# EAGLE design 373brd (EAGLE 6.6.0)
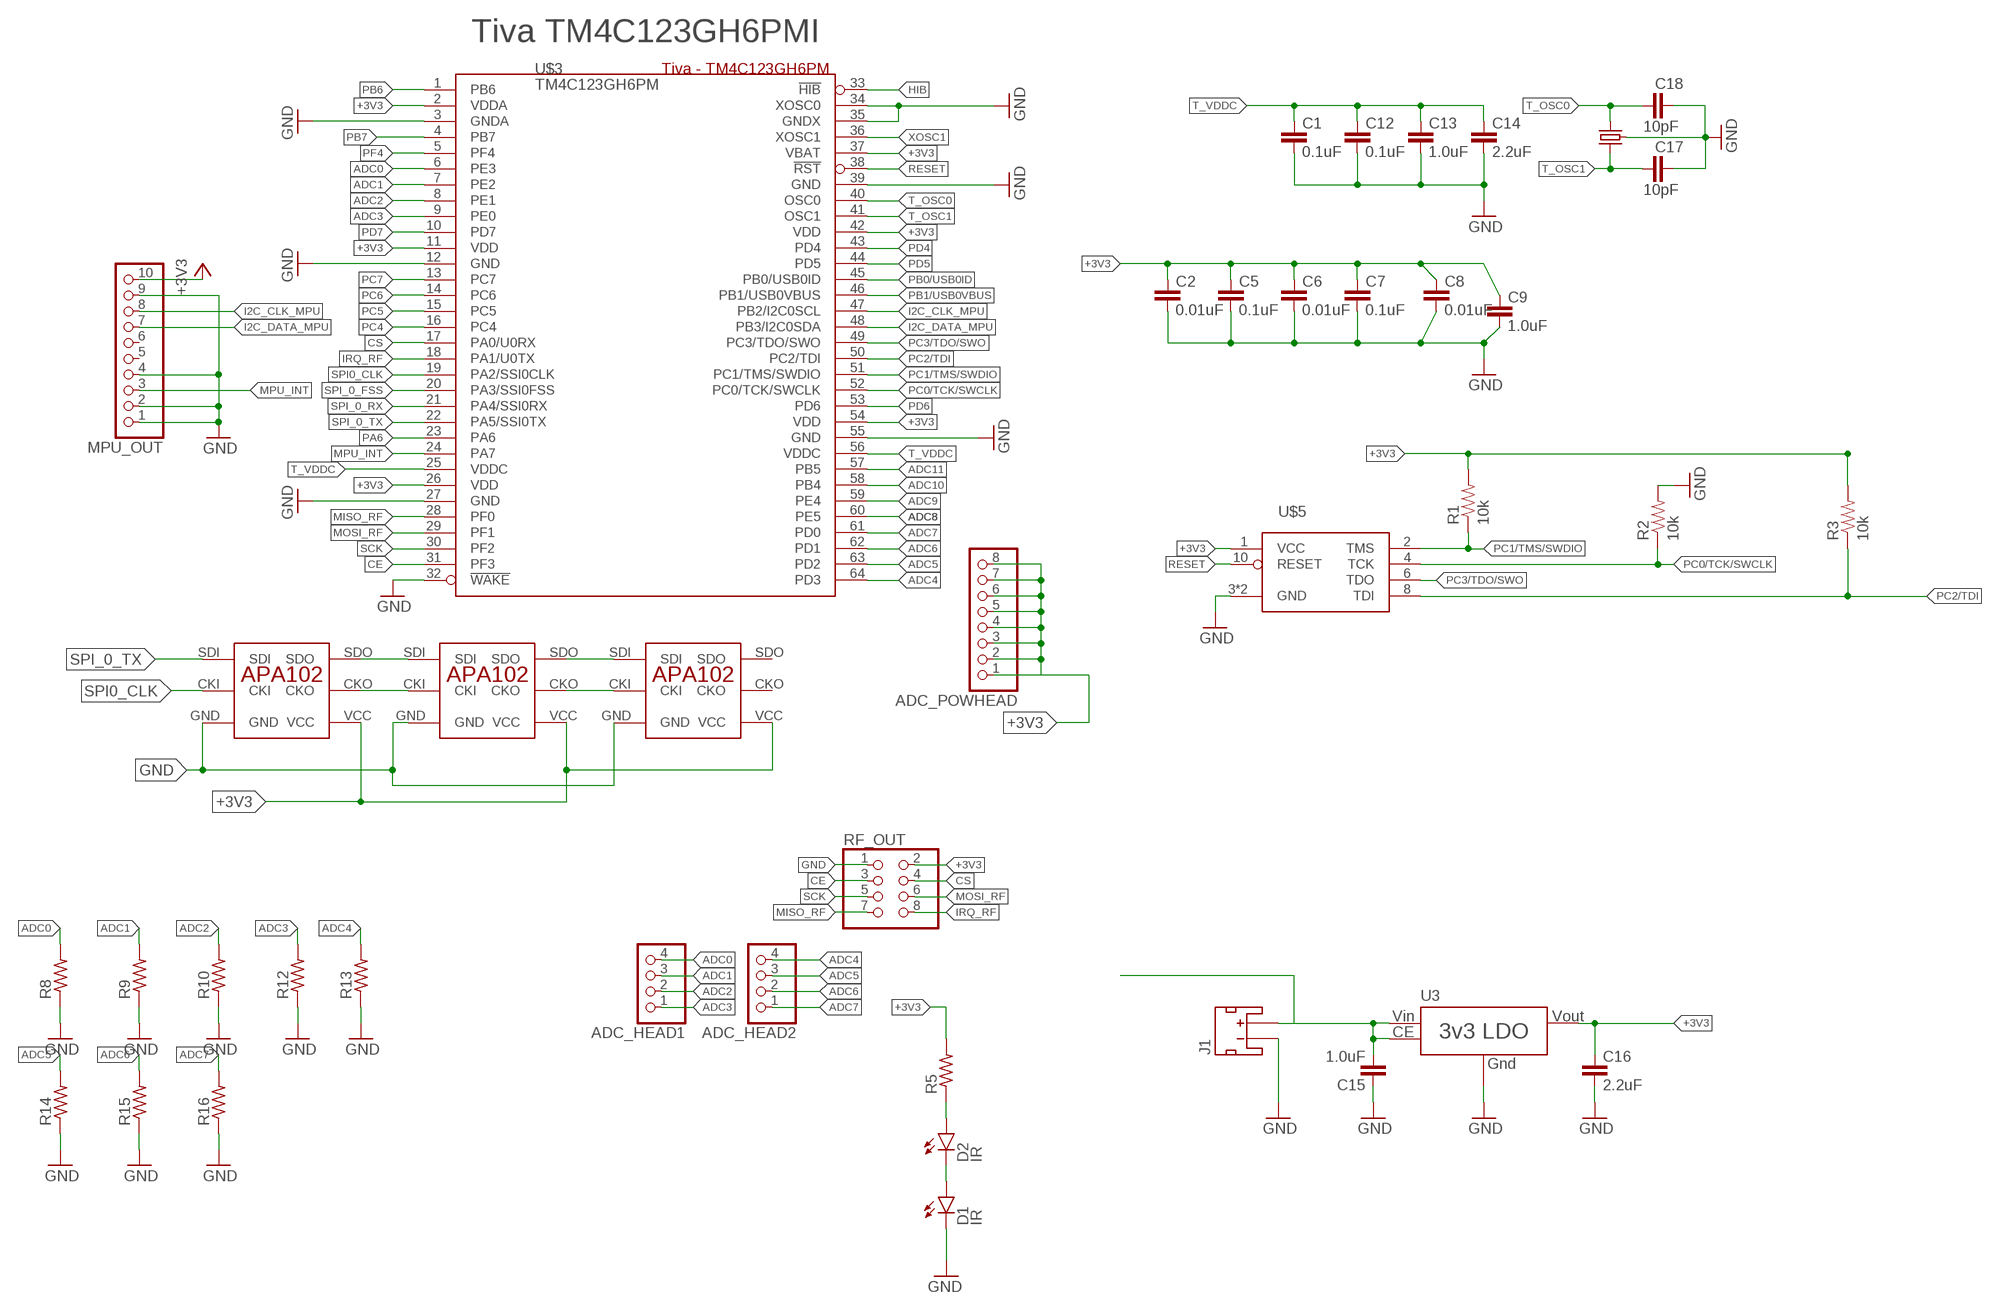
[diagram p0: schematic, sheet 1]

## Parts
ADC_HEAD1  PINHD-1X4  [1X04]
ADC_HEAD2  PINHD-1X4  [1X04]
ADC_POWHEAD  PINHD-1X8  [1X08]
C1  0.1uF  C-EUC0603  [C0603]
C2  0.01uF  C-EUC0603  [C0603]
C5  0.1uF  C-EUC0603  [C0603]
C6  0.01uF  C-EUC0603  [C0603]
C7  0.1uF  C-EUC0603  [C0603]
C8  0.01uF  C-EUC0603  [C0603]
C9  1.0uF  C-EUC0603  [C0603]
C12  0.1uF  C-EUC0603  [C0603]
C13  1.0uF  C-EUC0603  [C0603]
C14  2.2uF  C-EUC0603  [C0603]
C15  1.0uF  C-EUC0805  [C0805]
C16  2.2uF  C-EUC0805  [C0805]
C17  10pF  C-EUC0603  [C0603]
C18  10pF  C-EUC0603  [C0603]
D1  IR  LED-BLUE1206  [LED-1206]
D2  IR  LED-BLUE1206  [LED-1206]
J1  JST_2MM_MALE  [JST-2-SMD]
MPU_OUT  PINHD-1X10  [1X10]
R1  10k  RESISTOR0603-RES  [0603-RES]
R2  10k  RESISTOR0603-RES  [0603-RES]
R3  10k  RESISTOR0603-RES  [0603-RES]
R5  R-US_R0603  [R0603]
R8  R-US_R0603  [R0603]
R9  R-US_R0603  [R0603]
R10  R-US_R0603  [R0603]
R12  R-US_R0603  [R0603]
R13  R-US_R0603  [R0603]
R14  R-US_R0603  [R0603]
R15  R-US_R0603  [R0603]
R16  R-US_R0603  [R0603]
RF_OUT  PINHD-2X4  [2X04]
U3  XC6210  [SOT-25]
U$1  CRYSTAL_403C11E16  [4-SMD-SWITCH]
U$2  APA102  [APA102]
U$3  TM4C123GH6PM  [TM4C123GH6PM]
U$4  APA102  [APA102]
U$5  JTAG-ARM_TC-10  [TC2050-IDC]
U$6  APA102  [APA102]

## Nets
+3V3: ADC_POWHEAD.1 ADC_POWHEAD.2 ADC_POWHEAD.3 ADC_POWHEAD.4 ADC_POWHEAD.5 ADC_POWHEAD.6 ADC_POWHEAD.7 ADC_POWHEAD.8 C2.1 C5.1 C6.1 C7.1 C8.1 C9.1 C16.1 MPU_OUT.10 R1.2 R3.2 R5.2 RF_OUT.2 U3.5(VOUT) U$2.VCC U$3.2(VDDA) U$3.11(VDD) U$3.26(VDD) U$3.37(VBAT) U$3.42(VDD) U$3.54(VDD) U$4.VCC U$5.1(VCC) U$6.VCC
ADC0: ADC_HEAD1.4 R8.2 U$3.6(PE3)
ADC1: ADC_HEAD1.3 R9.2 U$3.7(PE2)
ADC2: ADC_HEAD1.2 R10.2 U$3.8(PE1)
ADC3: ADC_HEAD1.1 R12.2 U$3.9(PE0)
ADC4: ADC_HEAD2.4 R13.2 U$3.64(PD3)
ADC5: ADC_HEAD2.3 R14.2 U$3.63(PD2)
ADC6: ADC_HEAD2.2 R15.2 U$3.62(PD1)
ADC7: ADC_HEAD2.1 R16.2 U$3.61(PD0)
ADC8: U$3.60(PE5)
ADC9: U$3.59(PE4)
ADC10: U$3.58(PB4)
ADC11: U$3.57(PB5)
BATT_IN: C15.2 J1.2(+) U3.1(VIN) U3.3(CE)
CE: RF_OUT.3 U$3.31(PF3)
CS: RF_OUT.4 U$3.17(PA0/U0RX)
GND: C1.2 C2.2 C5.2 C6.2 C7.2 C8.2 C9.2 C12.2 C13.2 C14.2 C15.1 C16.2 C17.2 C18.2 D1.C J1.1(-) MPU_OUT.1 MPU_OUT.2 MPU_OUT.4 MPU_OUT.9 R2.2 R8.1 R9.1 R10.1 R12.1 R13.1 R14.1 R15.1 R16.1 RF_OUT.1 U3.2(GND) U$1.2(GND) U$1.4(GND) U$2.GND U$3.3(GNDA) U$3.12(GND) U$3.27(GND) U$3.32(!WAKE) U$3.34(XOSC0) U$3.35(GNDX) U$3.39(GND) U$3.55(GND) U$4.GND U$5.3(GND) U$5.9(GND) U$6.GND
HIB: U$3.33(!HIB)
I2C_CLK_MPU: MPU_OUT.8 U$3.47(PB2/I2C0SCL)
I2C_DATA_MPU: MPU_OUT.7 U$3.48(PB3/I2C0SDA)
IRQ_RF: RF_OUT.8 U$3.18(PA1/U0TX)
MISO_RF: RF_OUT.7 U$3.28(PF0)
MOSI_RF: RF_OUT.6 U$3.29(PF1)
MPU_INT: MPU_OUT.3 U$3.24(PA7)
N$1: U$2.SDO U$4.SDI
N$2: U$2.CKO U$4.CKI
N$3: U$4.SDO U$6.SDI
N$4: U$4.CKO U$6.CKI
N$5: D1.A D2.C
N$7: D2.A R5.1
PA6: U$3.23(PA6)
PB0/USB0ID: U$3.45(PB0/USB0ID)
PB1/USB0VBUS: U$3.46(PB1/USB0VBUS)
PB6: U$3.1(PB6)
PB7: U$3.4(PB7)
PC0/TCK/SWCLK: R2.1 U$3.52(PC0/TCK/SWCLK) U$5.4(TCK)
PC1/TMS/SWDIO: R1.1 U$3.51(PC1/TMS/SWDIO) U$5.2(TMS)
PC2/TDI: R3.1 U$3.50(PC2/TDI) U$5.8(TDI)
PC3/TDO/SWO: U$3.49(PC3/TDO/SWO) U$5.6(TDO)
PC4: U$3.16(PC4)
PC5: U$3.15(PC5)
PC6: U$3.14(PC6)
PC7: U$3.13(PC7)
PD4: U$3.43(PD4)
PD5: U$3.44(PD5)
PD6: U$3.53(PD6)
PD7: U$3.10(PD7)
PF4: U$3.5(PF4)
RESET: U$3.38(!RST) U$5.10(RESET)
SCK: RF_OUT.5 U$3.30(PF2)
SPI0_CLK: U$2.CKI U$3.19(PA2/SSI0CLK)
SPI_0_FSS: U$3.20(PA3/SSI0FSS)
SPI_0_RX: U$3.21(PA4/SSI0RX)
SPI_0_TX: U$2.SDI U$3.22(PA5/SSI0TX)
T_OSC0: C18.1 U$1.3 U$3.40(OSC0)
T_OSC1: C17.1 U$1.1 U$3.41(OSC1)
T_VDDC: C1.1 C12.1 C13.1 C14.1 U$3.25(VDDC) U$3.56(VDDC)
XOSC1: U$3.36(XOSC1)
Unconnected: J1.NC1(PAD1) J1.NC2(PAD2) MPU_OUT.5 MPU_OUT.6 U$6.CKO U$6.SDO

## Notes on the sheet
- Tiva TM4C123GH6PMI

## Library data of the parts
ADC_HEAD1 ADC_HEAD2 = pinhead:PINHD-1X4: PIN HEADER
ADC_POWHEAD = pinhead:PINHD-1X8: PIN HEADER
C1 C2 C5-C9 C12-C16 = Jon_LIB:C-EU: CAPACITOR, European symbol
C17 C18 = Jon_LIB:C-EU: CAPACITOR, European symbol; DIGIKEY#: 399-1049-1-ND
D1 D2 = SparkFun-LED:LED-BLUE: Blue LEDs for production use Various blue LEDs stocked by SparkFun production 0603 - DIO-08575 Rebel - DIO-09553 1206 - DIO-09911; PROD_ID: DIO-09911; VALUE: BLUE
J1 = SparkFun-Connectors:JST_2MM_MALE: Mates to single-cell LiPo batteries. CONN-08352; PROD_ID: CONN-08352
MPU_OUT = pinhead:PINHD-1X10: PIN HEADER
R1-R3 = SparkFun-Resistors:RESISTOR: Resistor Basic schematic elements and footprints for 0603, 1206, and PTH resistors.
R5 R8-R10 R12-R16 = resistor:R-US_: RESISTOR, American symbol
RF_OUT = pinhead:PINHD-2X4: PIN HEADER
U3 = MAAV:XC6210; DIGIKEY#: 893-1075-1-ND
U$1 = imu:CRYSTAL_403C11E16; DIGIKEY: 403C11E16M00000
U$2 U$4 U$6 = SAUVE:APA102
U$3 = MAAV:TM4C123GH6PM: Designed by Jason Leung - Michigan Autonomous Aerial Vehicles - Circuits Subteam; DIGIKEY#: 296-35849-ND
U$5 = MAAV:JTAG-ARM

## Board
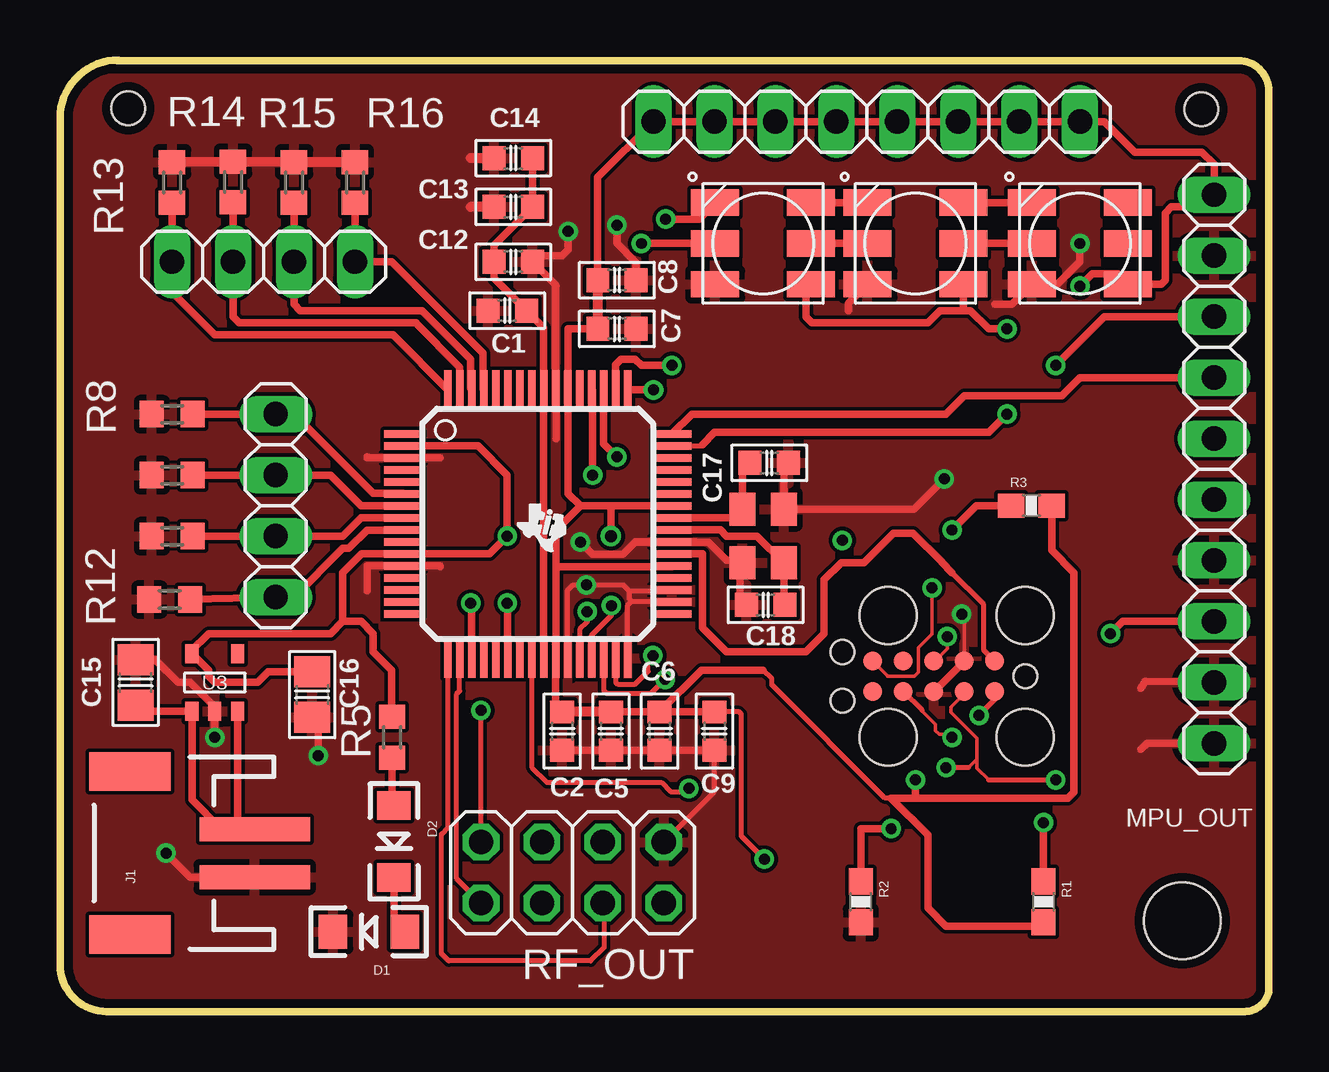
[diagram p1: board, top side]
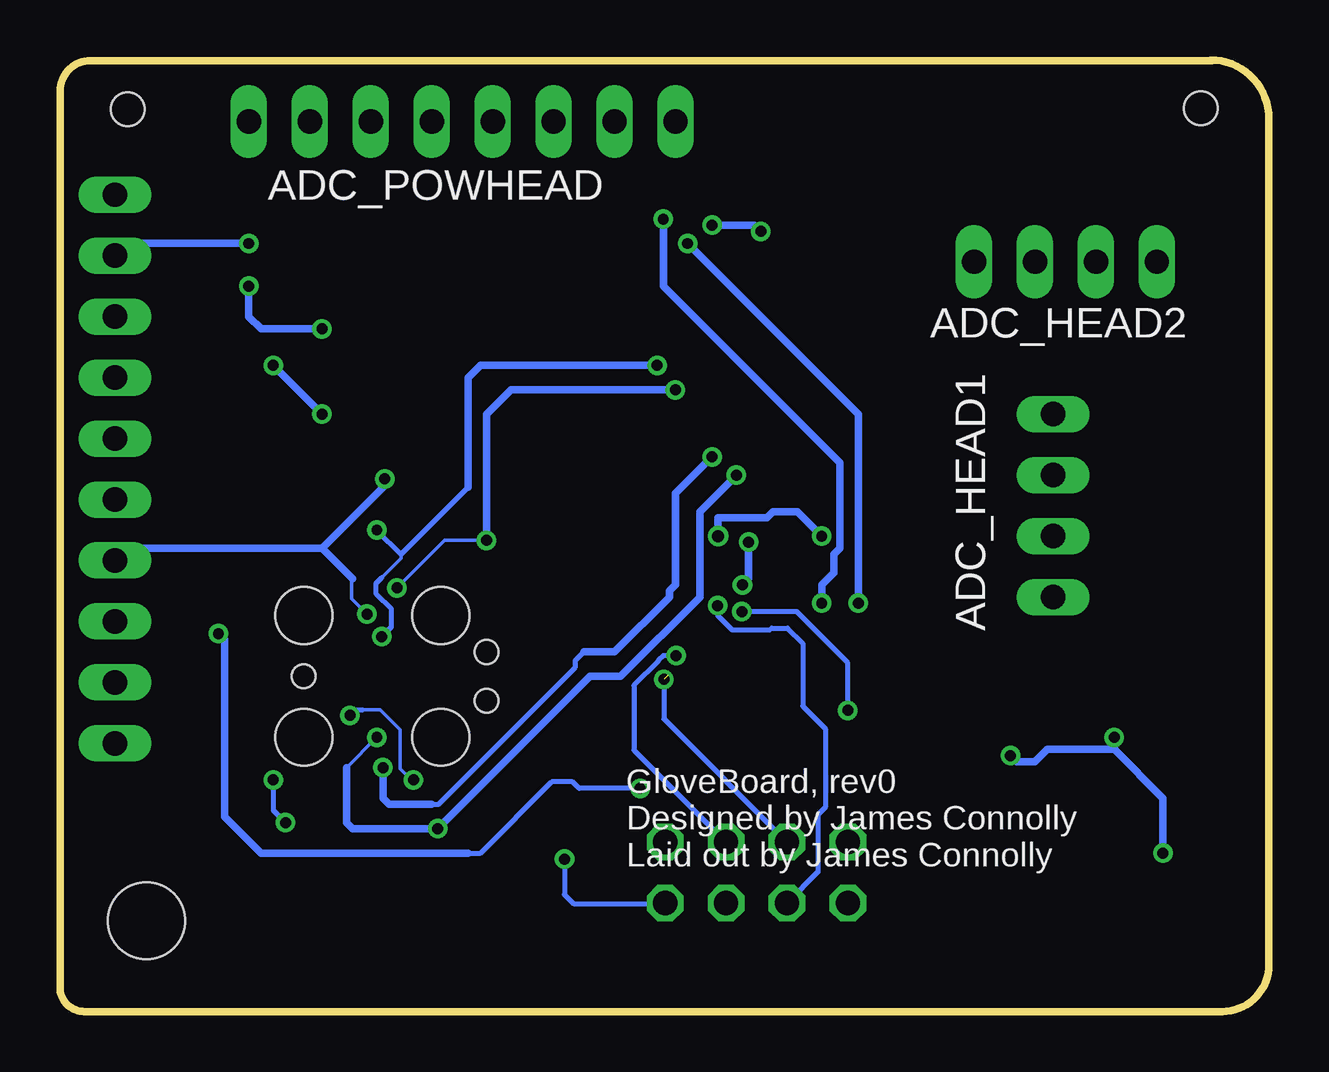
[diagram p2: board, bottom side, seen from below]

Size 50.39 x 39.65 mm. Coordinates in mm from the lower left corner, seen from the top.
Outline: 2.39,39.62 49.12,39.62 arc-90 50.39,38.35 50.39,1.02 arc-90 49.38,0 2.13,0
Outline: 2.03,0 1.96,0 arc-90 0,1.96 0,37.21 arc-90 2.44,39.65
Copper layers (1*16): Top 0.0356mm / dielectric 1.5011mm / Bottom 0.0356mm
Design rules "LaenPCBOrder": minimum track width 6mil, minimum drill 13mil, track to track 6mil, track to pad 6mil, pad to pad 6mil, via to via 6mil, smd to smd 6mil, copper to edge 15mil, drill to drill 6mil, minimum pad ring 7mil, minimum via ring 7mil, stop-mask expansion 3mil, vias tented up to drill 0mil, thermal gap 10mil
Holes 3.2 mm at 46.79,3.78
Holes 1.4 mm at 47.57,37.59 2.84,37.64

### Footprints (pad centres in the part's own frame; a part is rotated, then mirrored left to right if it is on the bottom)
1X04 = drill 1.016 long: 1 -3.81,0; 2 -1.27,0; 3 1.27,0; 4 3.81,0
1X08 = drill 1.016 long: 1 -8.89,0; 2 -6.35,0; 3 -3.81,0; 4 -1.27,0; 5 1.27,0; 6 3.81,0; 7 6.35,0; 8 8.89,0
C0603 = smd 0.95 x 1: 1 -0.8,0; 2 0.8,0
C0805 = smd 1.3 x 1.5: 1 -0.95,0; 2 0.95,0
LED-1206 = smd 1.2 x 1.4: A -1.5,0; C 1.5,0
JST-2-SMD = smd 1 x 4.6: 1 -1,-3.7; 2 1,-3.7 | smd 1.6 x 3.4: NC1 -3.4,1.5; NC2 3.4,1.5
1X10 = drill 1.016 long: 1 -11.43,0; 2 -8.89,0; 3 -6.35,0; 4 -3.81,0; 5 -1.27,0; 6 1.27,0; 7 3.81,0; 8 6.35,0; 9 8.89,0; 10 11.43,0
0603-RES = smd 1.1 x 1: 1 -0.85,0; 2 0.85,0
R0603 = smd 1 x 1.1: 1 -0.85,0; 2 0.85,0
2X04 = drill 1.016 octagon: 1 -3.81,-1.27; 2 -3.81,1.27; 3 -1.27,-1.27; 4 -1.27,1.27; 5 1.27,-1.27; 6 1.27,1.27; 7 3.81,-1.27; 8 3.81,1.27
SOT-25 = smd 0.55 x 0.8: 1 -0.95,-1.2; 2 0,-1.2; 3 0.95,-1.2; 4 0.95,1.2; 5 -0.95,1.2
4-SMD-SWITCH = smd 1.372 x 1.067: 1 -1.118,-0.864; 2 1.118,-0.864; 3 1.118,0.864; 4 -1.118,0.864
APA102 = smd 2 x 1.1: CKI -2,0; CKO 2,0; GND -2,-1.7; SDI -2,1.7; SDO 2,1.7; VCC 2,-1.7
TM4C123GH6PM = smd 1.6 x 0.3: 1 -5.6,3.75; 2 -5.6,3.25; 3 -5.6,2.75; 4 -5.6,2.25; 5 -5.6,1.75; 6 -5.6,1.25; 7 -5.6,0.75; 8 -5.6,0.25; 9 -5.6,-0.25; 10 -5.6,-0.75; 11 -5.6,-1.25; 12 -5.6,-1.75; 13 -5.6,-2.25; 14 -5.6,-2.75; 15 -5.6,-3.25; 16 -5.6,-3.75; 33 5.6,-3.75; 34 5.6,-3.25; 35 5.6,-2.75; 36 5.6,-2.25; 37 5.6,-1.75; 38 5.6,-1.25; 39 5.6,-0.75; 40 5.6,-0.25; 41 5.6,0.25; 42 5.6,0.75; 43 5.6,1.25; 44 5.6,1.75; 45 5.6,2.25; 46 5.6,2.75; 47 5.6,3.25; 48 5.6,3.75 | smd 0.3 x 1.6: 17 -3.75,-5.6; 18 -3.25,-5.6; 19 -2.75,-5.6; 20 -2.25,-5.6; 21 -1.75,-5.6; 22 -1.25,-5.6; 23 -0.75,-5.6; 24 -0.25,-5.6; 25 0.25,-5.6; 26 0.75,-5.6; 27 1.25,-5.6; 28 1.75,-5.6; 29 2.25,-5.6; 30 2.75,-5.6; 31 3.25,-5.6; 32 3.75,-5.6; 49 3.75,5.6; 50 3.25,5.6; 51 2.75,5.6; 52 2.25,5.6; 53 1.75,5.6; 54 1.25,5.6; 55 0.75,5.6; 56 0.25,5.6; 57 -0.25,5.6; 58 -0.75,5.6; 59 -1.25,5.6; 60 -1.75,5.6; 61 -2.25,5.6; 62 -2.75,5.6; 63 -3.25,5.6; 64 -3.75,5.6
TC2050-IDC = smd 0.787 x 0.787: 1 1.27,0.635; 2 2.54,0.635; 3 3.81,0.635; 4 5.08,0.635; 5 6.35,0.635; 6 6.35,-0.635; 7 5.08,-0.635; 8 3.81,-0.635; 9 2.54,-0.635; 10 1.27,-0.635 | hole 0.991: 7.62,1.016; 7.62,-1.016; 0,0 | hole 2.375: 0,2.54; 0,-2.54; 5.715,2.54; 5.715,-2.54

### Placement (x,y rotation side)
ADC_HEAD1  8.99,21.08 90 top
ADC_HEAD2  8.48,31.24 180 top
ADC_POWHEAD  33.63,37.08 180 top
C1  18.64,29.21 180 top
C2  20.93,11.68 270 top
C5  22.96,11.68 270 top
C6  24.99,11.68 270 top
C7  23.22,28.45 0 top
C8  23.22,30.48 0 top
C9  27.28,11.68 270 top
C12  18.9,31.24 0 top
C13  18.9,33.53 180 top
C14  18.9,35.56 180 top
C15  3.15,13.72 270 top
C16  10.52,13.21 270 top
C17  29.57,22.86 0 top
C18  29.41,16.94 180 top
D1  12.88,3.33 180 top
D2  13.92,7.09 270 top
J1  4.42,6.6 90 top
MPU_OUT  48.11,22.61 90 top
R1  41,4.57 270 top
R2  33.38,4.57 270 top
R3  40.49,21.08 0 top
R5  13.84,11.43 90 top
R8  4.67,24.89 0 top
R9  4.67,22.35 0 top
R10  4.67,19.81 0 top
R12  4.57,17.17 0 top
R13  4.67,34.54 270 top
R14  7.21,34.57 270 top
R15  9.75,34.54 270 top
R16  12.29,34.54 270 top
RF_OUT  21.36,5.79 180 top
U3  6.45,13.72 0 top
U$1  29.31,19.81 270 top
U$2  29.31,32 0 top
U$3  19.91,20.32 0 top
U$4  35.66,32 0 top
U$5  40.23,13.97 180 top
U$6  42.52,32 0 top

### Tracks (layer width: path | path; a pad name or v marks a point on that pad's centre or on a via)
+3V3  (via drill 0.46, 0.46 pad 0.3, 0.5)
  Top 0.203: U$5.1 38.96,13 v38.3,12.34 | 34.65,8.89 34.39,8.89 29.67,13.61 29.67,13.87 29.31,14.22 | C9.1 28.31,12.48 28.4,12.39 28.4,7.31 v29.36,6.35
  Top 0.305: U$3.54 21.18,25.92 | 21.18,25.92 21.18,28.45 C7.1 | 25.51,18.54 U$3.37 25.49,18.54 20.68,18.54 | U$3.42 22.96,21.07 | 22.96,21.07 21.69,21.07 | 21.18,25.92 21.18,21.58 21.69,21.07 | v22.96,19.81 22.96,21.07 | C2.1 20.66,12.75 U$3.26 20.68,14.72 20.68,18.54 | 35.66,8.89 42.01,8.89 42.27,9.14 42.27,18.29 41.34,19.22 R3.2 | 35.66,8.89 34.65,8.89 36.17,7.37 36.17,4.32 36.93,3.56 40.83,3.56 R1.2 | C5.1 C6.1 | 29.31,14.22 26.73,14.22 C6.1 | C8.1 22.42,34.76 ADC_POWHEAD.8 ADC_POWHEAD.7 ADC_POWHEAD.6 ADC_POWHEAD.5 ADC_POWHEAD.4 ADC_POWHEAD.3 ADC_POWHEAD.2 ADC_POWHEAD.1 43.54,37.08 44.81,35.81 47.6,35.81 48.11,35.31 MPU_OUT.10 47.6,33.53 46.33,33.53 46.08,33.27 46.08,30.48 45.9,30.3 U$6.VCC 44.09,30.73 43.03,30.73 v42.52,30.23 | U$3.2 17.43,23.57 18.64,22.35 v18.64,19.81 17.9,19.07 U$3.11 12.57,19.07 11.79,18.29 11.79,16.26 | C9.1 C6.1 | C16.1 8.67,14.16 8.23,13.72 6.45,13.72 6.2,13.97 6.2,14.22 U3.5 5.44,14.92 5.44,14.99 6.2,15.75 11.28,15.75 11.79,16.26 | 20.68,18.54 20.68,20.05 21.69,21.07 | 11.79,16.26 12.55,16.26 13.06,15.75 13.06,14.99 13.82,14.22 13.82,12.3 R5.2 | v39.47,28.45 38.71,28.45 37.95,29.21 37.69,29.21 | 37.69,29.21 36.68,29.21 36.17,28.7 31.34,28.7 31.09,28.96 31.09,30.08 U$2.VCC | U$4.VCC 37.66,29.24 37.69,29.21 | v35.66,9.65 35.66,8.89
  Top 0.406: C8.1 C7.1 | C5.1 C2.1
  Bottom 0.152: 37.8,12.57 37.06,12.57 36.22,11.73 36.22,10.11 35.76,9.65 v35.66,9.65
  Bottom 0.203: v38.3,12.34 38.07,12.57 37.8,12.57 | v29.36,6.35 29.36,4.88 28.98,4.5 25.2,4.5 RF_OUT.2
  Bottom 0.305: v39.47,28.45 42.01,28.45 42.52,28.96 v42.52,30.23 | v22.96,19.81 22.96,20.57 20.93,20.57 20.68,20.83 19.66,20.83 v18.64,19.81
ADC0
  Top 0.305: R8.2 ADC_HEAD1.4 9.75,24.89 13.06,21.59 14.29,21.59 U$3.6
ADC1
  Top 0.305: R9.2 ADC_HEAD1.3 11.28,22.35 12.56,21.07 U$3.7
ADC2
  Top 0.305: R10.2 ADC_HEAD1.2 11.79,19.81 12.55,20.57 U$3.8
ADC3
  Top 0.305: R12.2 ADC_HEAD1.1 9.75,17.27 11.79,19.3 12.04,19.3 12.8,20.07 U$3.9
ADC4
  Top 0.305: R13.2 ADC_HEAD2.4 4.67,29.97 6.45,28.19 13.89,28.19 U$3.64
ADC5
  Top 0.305: R14.2 ADC_HEAD2.3 7.21,28.96 7.47,28.7 14.83,28.7 14.83,28.68 16.66,26.85 U$3.63
ADC6
  Top 0.305: R15.2 ADC_HEAD2.2 9.75,29.46 10.01,29.21 15.09,29.21 17.12,27.18 17.12,25.96 U$3.62
ADC7
  Top 0.305: R16.2 ADC_HEAD2.1 13.82,31.24 17.63,27.43 17.63,25.96 U$3.61
BATT_IN
  Top 0.305: 7.47,7.62 6.71,7.62 5.5,8.82 U3.1 3.4,12.52 C15.2 | 7.47,7.62 8.1,7.62 J1.2 | U3.3 7.4,7.69 7.47,7.62
CE  (via drill 0.46)
  Top 0.203: RF_OUT.3 22.61,7.09 | v24.71,14.83 24.51,14.63 24.51,14.17 23.98,13.64 23.24,13.64 23.16,13.72 U$3.31
  Bottom 0.203: v24.71,14.83 25.25,14.83 25.45,14.63 25.45,14.61 26.47,13.59 26.47,10.9 RF_OUT.3
CS
  Top 0.203: RF_OUT.4 22.68,4.47 22.68,2.67 22.12,2.11 16.21,2.11 15.9,2.41 15.9,7.39 16.16,7.65 U$3.17
GND  (via drill 0.46, 0.46 pad 0.3)
  Top 0.152: U$5.9 37.69,16.46 v37.59,16.56
  Top 0.203: 25.46,17.02 U$3.34 25.49,17.09 23.83,17.09 | RF_OUT.1 27.28,9.17 C9.2 | 23.72,17.53 23.47,17.78 v21.95,17.78 21.39,17.78 21.16,17.56 U$3.27 | 23.72,17.53 25.47,17.53 U$3.35 | 23.72,17.53 23.72,17.2 23.83,17.09 | U$3.32 23.66,16.93 23.83,17.09
  Top 0.305: 15.85,18.54 15.85,18.57 U$3.12 12.8,18.57 12.8,17.53 | 15.85,23.07 U$3.3 12.8,23.07 12.8,23.11 | U$3.39 24.24,19.57 24.23,19.56 | 20.68,23.88 20.68,25.92 U$3.55 20.66,30.24 | C9.2 C6.2 C5.2 C2.2 | 20.66,30.24 20.66,30.28 C12.2 19.95,31.5 20.93,31.5 21.18,31.75 v21.18,32.51 | 20.66,30.24 20.68,30.23 | U$3.39 26.51,19.57 26.52,19.56 | U$3.39 23.99,19.57 23.98,19.56 | 26.52,19.56 27.03,19.56 27.79,18.8 28.35,18.8 | 28.35,18.8 U$1.2 | 38.96,29.46 39.68,29.46 U$6.GND 41.58,30.3 42.52,31.24 v42.52,32 | U$4.GND 32.87,29.51 32.87,29.21 | C15.1 3.98,14.67 4.93,13.72 5.44,13.72 6.45,12.7 U3.2 v6.45,11.43 | J1.1 5.42,5.6 v4.42,6.6 | v10.77,10.67 10.77,12 C16.2 | C17.2 30.18,22.67 U$1.4 35.59,20.93 v36.86,22.2 | 21.18,14.74 U$3.27 | MPU_OUT.2 45.24,13.77 45.06,13.46 | MPU_OUT.1 45.31,11.18 45.06,10.92 | C8.2 24.02,31.2 23.22,32 v23.22,32.77 | 36.42,13.21 U$5.3 U$5.9 | 26.52,19.56 23.98,19.56 | 23.98,19.56 23.47,19.05 22.2,19.05 v21.69,19.56 | 28.35,18.8 28.35,17.21 C18.2
  Top 0.406: R16.1 R15.1 R14.1 R13.1 | C13.2 17.12,33.53 | C14.2 17.12,35.56
  Bottom 0.152: v37.59,16.56 38.23,17.2 38.23,18.01
  Bottom 0.203: 38.23,18.01 38.2,18.03
  Bottom 0.305: v4.42,6.6 4.42,8.89 6.45,10.92 | 6.45,10.92 9.25,10.92 9.75,10.41 10.52,10.41 v10.77,10.67 | v6.45,11.43 6.45,10.92 | v23.22,32.77 21.44,32.77 v21.18,32.51 | MPU_OUT.9 47.6,32 v42.52,32 | 38.2,18.03 39.47,19.3 | 39.47,19.3 47.6,19.3 MPU_OUT.4 | v21.69,19.56 21.69,18.03 v21.95,17.78 | v36.86,22.2 36.86,21.92 39.47,19.3
  pour Top: 0,36.17 arc-90 0.05,36.12 0.05,1.68 arc90 1.8,-0.08 49.2,-0.08 arc90 50.44,1.17 50.44,38.35 arc90 49.25,39.55 2.11,39.55 arc90 0.08,37.52
I2C_CLK_MPU  (via drill 0.46)
  Top 0.203: U$3.47 26.72,23.57 26.77,23.62
  Top 0.305: MPU_OUT.8 43.54,28.96 v41.5,26.92 | v39.47,24.89 38.71,24.13 27.28,24.13 26.77,23.62
  Bottom 0.305: v41.5,26.92 v39.47,24.89
I2C_DATA_MPU
  Top 0.305: MPU_OUT.7 42.52,26.42 41.76,25.65 37.69,25.65 36.93,24.89 26.34,24.89 U$3.48
IRQ_RF
  Top 0.203: RF_OUT.8 16.54,5.54 16.54,13.23 16.66,13.36 U$3.18
MISO_RF  (via drill 0.46)
  Top 0.203: v21.97,16.66 21.97,16.23 21.67,15.93 U$3.28 | RF_OUT.7 v17.55,12.55
  Bottom 0.203: v21.97,16.66 19.68,16.66 17.55,14.53 v17.55,12.55
MOSI_RF  (via drill 0.46)
  Top 0.203: U$3.29 22.16,15.69 22.99,16.51 v22.99,16.92
  Bottom 0.203: RF_OUT.6 18.8,5.82 18.8,8.2 18.49,8.51 18.49,11.79 19.43,12.72 19.43,15.34 20.07,15.98 20.73,15.98 20.8,15.9 22.38,15.9 22.99,16.51 v22.99,16.92
MPU_INT  (via drill 0.46)
  Top 0.203: U$3.24 19.66,10.18 20.29,9.55 25.07,9.55 25.45,9.17 26.09,9.17 v26.21,9.3
  Top 0.305: 47.09,16.26 MPU_OUT.3 44.3,16.26 v43.79,15.75
  Bottom 0.203: 33.38,6.6 32.87,6.6 29.9,9.58 29.03,9.58 28.75,9.3 v26.21,9.3
  Bottom 0.305: 33.38,6.6 42.01,6.6 43.54,8.13 43.54,15.49 v43.79,15.75
N$1
  Top 0.305: U$2.SDO U$4.SDI
N$2
  Top 0.305: U$2.CKO U$4.CKI
N$3
  Top 0.305: U$4.SDO U$6.SDI
N$4
  Top 0.305: U$4.CKO U$6.CKI
N$5
  Top 0.305: D2.C 13.92,3.79 D1.A
N$7
  Top 0.305: R5.1 13.84,8.66 D2.A
PC0/TCK/SWCLK  (via drill 0.46, 0.46 pad 0.3)
  Top 0.152: 35.94,12.55 35.94,12.52 36.5,11.96 36.5,11.71 36.65,11.56 37.06,11.56 v37.19,11.43
  Top 0.203: 35.94,12.55 U$5.4
  Top 0.305: v22.2,22.35 22.2,25.88 U$3.52 | v34.65,7.62 33.38,7.62 R2.1
  Top 0.406: U$5.4 35.28,13.33
  Bottom 0.152: v37.19,11.43 38.46,10.16
  Bottom 0.305: v22.2,22.35 23.72,20.83 23.72,17.27 27.03,13.97 28.3,13.97 v34.65,7.62 38.2,7.62 38.46,7.87 38.46,10.16
PC1/TMS/SWDIO  (via drill 0.46, 0.46 pad 0.3)
  Top 0.152: 37.82,13.33 37.8,13.33 37.13,12.67 37.13,12.47 38.23,11.38 38.23,10.52 | 38.23,10.52 37.87,10.16 | 38.23,10.52 38.23,10.13 38.71,9.65
  Top 0.203: 37.87,10.16 v36.93,10.16 | 38.71,9.65 v41.5,9.65
  Top 0.305: U$3.51 22.66,23.67 v23.22,23.11 | R1.1 v41,7.87 | U$5.2 37.82,13.33
  Bottom 0.203: v41.5,9.65 41.5,8.38 v41,7.87 | 34.9,8.64 34.62,8.64 28.91,14.35 28.91,14.63 28.55,14.99
  Bottom 0.305: v23.22,23.11 24.74,21.59 24.74,17.78 24.99,17.53 24.99,17.27 27.28,14.99 28.55,14.99 | v36.93,10.16 36.93,8.89 36.68,8.64 34.9,8.64
PC2/TDI  (via drill 0.46, 0.46 pad 0.3)
  Top 0.152: U$5.8 36.47,14.61 36.98,15.11 v36.98,15.62
  Top 0.305: v25.5,26.92 24.23,26.92 23.98,27.18 23.39,27.18 23.16,26.95 U$3.50 | R3.1 38.2,21.08 v37.19,20.07
  Bottom 0.152: 36.17,19.05 36.17,18.9 36.98,18.09
  Bottom 0.203: 33.38,21.84 36.17,19.05 v37.19,20.07 | v36.98,15.62 36.58,16.03 36.58,16.76 37.21,17.4 37.21,17.86 36.98,18.09
  Bottom 0.305: v25.5,26.92 32.87,26.92 33.38,26.42 33.38,21.84
PC3/TDO/SWO  (via drill 0.46, 0.46 pad 0.3)
  Top 0.152: U$5.6 34.49,13.99 34.49,13.97 35.61,13.97 35.79,14.15 35.79,15.16 36.35,15.72 v36.35,17.65
  Top 0.305: v24.74,25.91 v24.74,25.92 U$3.49
  Bottom 0.152: v36.35,17.65 34.37,19.63 v32.61,19.63 32.66,19.63
  Bottom 0.305: v24.74,25.91 31.6,25.91 32.61,24.89 v32.61,19.63
RESET
  Top 0.203: U$5.10 38.51,15.06 38.51,16.97 37.19,18.29
  Top 0.305: U$3.38 26.77,19.07 26.77,16 27.79,14.99 31.09,14.99 31.85,15.75 31.85,17.98 32.56,18.69 33.5,18.69 34.75,19.94 35.56,19.94 36.75,18.75 36.75,18.72 37.19,18.29 | 38.96,14.73 38.71,14.73
  Top 0.406: U$5.10 38.96,14.73
SCK  (via drill 0.46)  (1 unrouted)
  Top 0.203: RF_OUT.5 20.37,7.34 | U$3.30 22.66,13.38 22.78,13.26 24.64,13.26 v25.22,13.84
  Bottom 0.203: v25.22,13.84 25.22,12.19 RF_OUT.5
SPI0_CLK  (via drill 0.46)
  Top 0.305: U$3.19 17.16,16.97 v17.12,17.02 | v24.23,32 U$2.CKI
  Bottom 0.305: v17.12,17.02 17.12,24.89 v24.23,32
SPI_0_TX  (via drill 0.46)
  Top 0.305: U$3.22 18.66,17 v18.64,17.02 | v25.25,33.02 26.63,33.02 U$2.SDI
  Bottom 0.305: v18.64,17.02 18.64,17.78 18.14,18.29 18.14,19.05 17.88,19.3 17.88,22.86 25.25,30.23 v25.25,33.02
T_OSC0
  Top 0.305: U$3.40 27.53,20.07 27.79,19.81 29.06,19.81 U$1.3 30.18,16.98 C18.1
T_OSC1
  Top 0.305: U$3.41 28.09,20.57 U$1.1 28.45,22.86 C17.1
T_VDDC
  Top 0.305: U$3.25 U$3.56 20.16,28.49 C1.1 18.1,30.56 C12.1 18.1,31.93 C13.1 C14.1

### Text on the board
bPlace: GloveBoard, rev0 / Designed by James Connolly / Laid out by James Connolly